# Altium project İHA-PDU.PrjPcb (part 10 of 13)
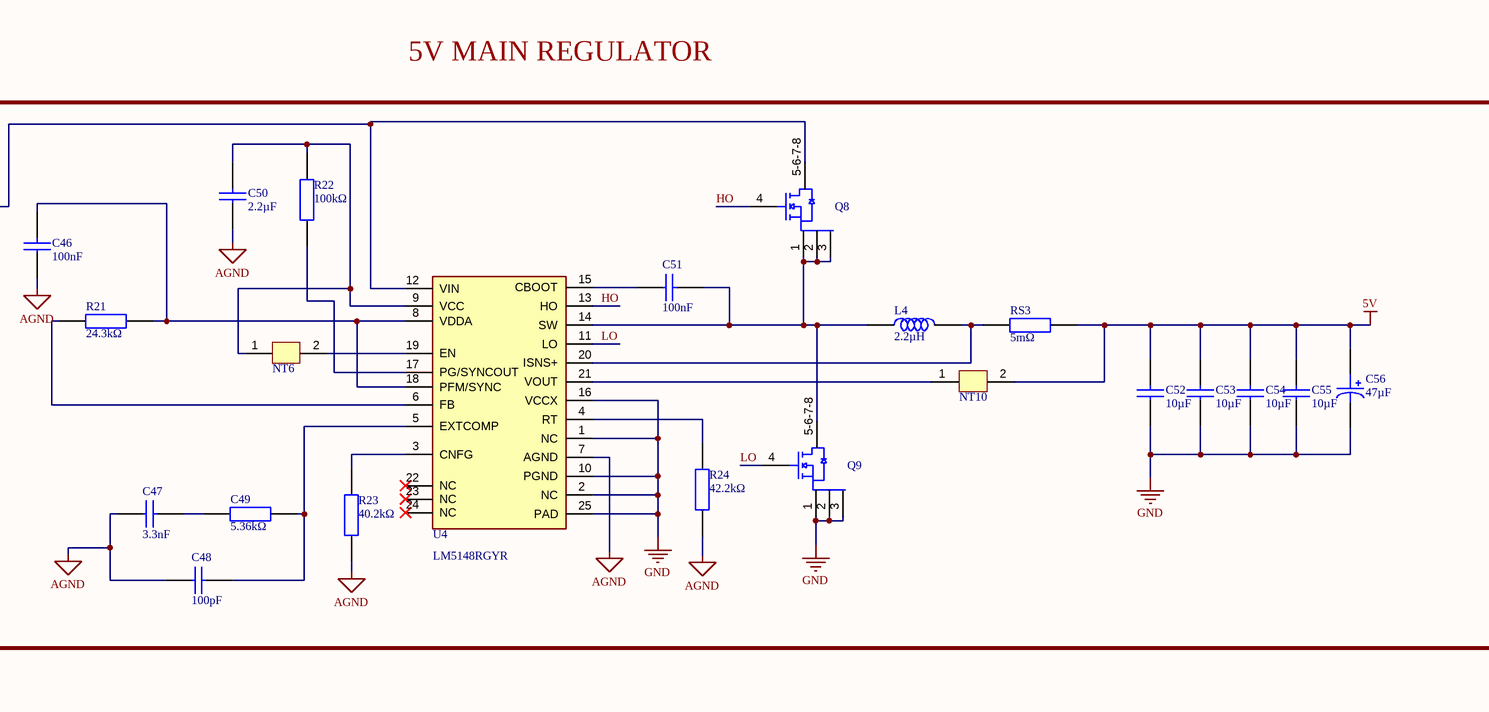
[diagram p16: 5V_Power_Stage.SchDoc, right]

## Sheet 5V_Power_Stage.SchDoc (continued)
### Library data of the parts
C44 C56 = EEHZA1H470P: Conductive Polymer Hybrid Aluminum Electrolytic Capacitors, 47µF, 50V, -55 to 105¡C; Manufacturer: Panasonic; Manufacturer Part Number: EEH-ZA1H470P; Manufacturer Lifecycle Status: ACTIVE; Part Series: ZA (High temp. reflow); ESR (Equivalent Series Resistance): 30mΩ; Leakage Current: 23.5µA; Life (Hours): 10000hours; Ripple Current: 1.8A; Tolerance: 20%; Supplier: Farnell; Supplier Part Number: EEHZA1H470P; RoHS: Compliant; Category: Aluminum Electrolytic Capacitors; Stock: 93; Pricing: 1=1,14, 10=0,637, 50=0,607, 100=0,576, 200=0,528, 500=0,479 (EUR); Case/Package: 3333; Country of Origin: Japan; Diameter: 8mm; Export Control Classification Number (ECCN) Code: EAR99; Height: 10.2mm; Harmonized Tariff Schedule (HTS) Code: 8532.22.00.20; Introduction Date: 2019-05-31; Length: 10.2mm; Lifecycle Status: Production; Material: Polymer; Max Operating Temperature: 105°C; Min Operating Temperature: -55°C; Mounting Technology: Surface Mount; Number of Terminals: 2; Ratings: AEC-Q200; REACH SVHC: Yes; Voltage Rating: 50V; Voltage Rating (DC): 50V; Width: 8.3mm; ComponentLink1URL: https://datasheet.octopart.com:443/EEH-ZA1H470P-Panasonic-datasheet-68301292.pdf?src-supplier=Panasonic; ComponentLink1Description: https://datasheet.octopart.com:443/EEH-ZA1H470P-Panasonic-datasheet-68301292.pdf?src-supplier=Panasonic; ComponentLink2URL: https://datasheet.octopart.com:443/EEH-ZA1H470P-Panasonic-datasheet-136612405.pdf?src-supplier=Electro+Sonic; ComponentLink2Description: https://datasheet.octopart.com:443/EEH-ZA1H470P-Panasonic-datasheet-136612405.pdf?src-supplier=Electro+Sonic; ComponentLink3URL: https://datasheet.octopart.com:443/EEHZA1H470P-Panasonic-datasheet-137675046.pdf?src-supplier=TME; ComponentLink3Description: https://datasheet.octopart.com:443/EEHZA1H470P-Panasonic-datasheet-137675046.pdf?src-supplier=TME
C45 = C3216X7R1H106K160AC: 50V 10uF X7R 卤10% 1206 Multilayer Ceramic Capacitors MLCC - SMD/SMT ROHS; Manufacturer: TDK; Manufacturer Lifecycle Status: PRODUCTION; Supplier: Farnell; Supplier Part Number: C3216X7R1H106K160AC; Manufacturer Part Number: C3216X7R1H106K160AC; RoHS: Compliant; Category: Ceramic Capacitors; Stock: 6363; Pricing: 5=0,77, 50=0,378, 250=0,344, 500=0,286, 1000=0,268, 2000=0,259 (EUR); Case/Package: 1206; Case Code (Metric): 3216; China RoHS: Compliant; Dielectric: X7R; Dielectric Material: Ceramic; Export Control Classification Number (ECCN) Code: EAR99; Height: 1.6mm; Harmonized Tariff Schedule (HTS) Code: 8532.24.00.20; Introduction Date: 2018-03-29; Lead Free: Lead Free; Length: 3.2mm; Lifecycle Status: Production; Material: Ceramic; Max Length: 3.5mm; Max Operating Temperature: 125°C; Max Width: 1.9mm; Min Length: 3.1mm; Min Operating Temperature: -55°C; Min Width: 1.5mm; Mounting Technology: Surface Mount; Number of Terminals: 2; REACH SVHC: Yes; Schedule B: 8532240020, 8532240020|8532240020|8532240020|8532240020|8532240020; Thickness: 1.6mm; Voltage Rating: 50V; Voltage Rating (DC): 50V; Width: 1.6mm; ComponentLink1URL: https://datasheet.octopart.com:443/C3216X7R1H106K160AC-TDK-datasheet-175423548.pdf?src-supplier=TME; ComponentLink1Description: https://datasheet.octopart.com:443/C3216X7R1H106K160AC-TDK-datasheet-175423548.pdf?src-supplier=TME; ComponentLink2URL: https://datasheet.octopart.com:443/C3216X7R1H106K160AC-TDK-datasheet-182135025.pdf?src-supplier=TME; ComponentLink2Description: https://datasheet.octopart.com:443/C3216X7R1H106K160AC-TDK-datasheet-182135025.pdf?src-supplier=TME; ComponentLink3URL: https://datasheet.octopart.com:443/C3216X7R1H106K160AC-TDK-datasheet-159617022.pdf?src-supplier=TME; ComponentLink3Description: https://datasheet.octopart.com:443/C3216X7R1H106K160AC-TDK-datasheet-159617022.pdf?src-supplier=TME; ComponentLink4URL: https://datasheet.octopart.com:443/C3216X7R1H106K160AC-TDK-datasheet-151546523.pdf?src-supplier=ODG+(Origin+Data+Global); ComponentLink4Description: https://datasheet.octopart.com:443/C3216X7R1H106K160AC-TDK-datasheet-151546523.pdf?src-supplier=ODG+(Origin+Data+Global); ComponentLink5URL: https://datasheet.octopart.com/C3216X7R1H106K160AC-TDK-datasheet-41194876.pdf; ComponentLink5Description: https://datasheet.octopart.com/C3216X7R1H106K160AC-TDK-datasheet-41194876.pdf; ComponentLink6URL: https://datasheet.octopart.com/C-Series-Ceramic-Chip-Capacitors-TDK-datasheet-family-84.pdf; ComponentLink6Description: https://datasheet.octopart.com/C-Series-Ceramic-Chip-Capacitors-TDK-datasheet-family-84.pdf; ComponentLink7URL: http://sigma.octopart.com:80/rohs_certificate/C-Series-Ceramic-Chip-Capacitors-TDK-family-108.pdf?src-supplier=Compliance+Statements; ComponentLink7Description: http://sigma.octopart.com:80/rohs_certificate/C-Series-Ceramic-Chip-Capacitors-TDK-family-108.pdf?src-supplier=Compliance+Statements
C46 C51 = GRM155R71A104KA01D: 10V 100nF X7R ±10% 0402 Multilayer Ceramic Capacitors MLCC - SMD/SMT ROHS; Manufacturer: Murata; Manufacturer Lifecycle Status: NRND; Dissipation Factor: 0.035%; Supplier: Farnell; Supplier Part Number: GRM155R71A104KA01D; Manufacturer Part Number: GRM155R71A104KA01D; RoHS: Compliant; Category: Ceramic Capacitors; Stock: 200000; Pricing: 10000=0,0029 (EUR); Case/Package: 0402; Case Code (Imperial): 0402; Case Code (Metric): 1005; Country of Origin: Japan, Mainland China, Philippines, Singapore, Thailand; Depth: 500µm; Dielectric: X7R; Dielectric Material: Ceramic; Export Control Classification Number (ECCN) Code: EAR99; Height: 500µm; Harmonized Tariff Schedule (HTS) Code: 8532.24.00.20; Introduction Date: 2004-11-19; Lead Free: Lead Free; Length: 1mm; Lifecycle Status: NRND; Material: Ceramic; Max Operating Temperature: 125°C; Min Operating Temperature: -55°C; Mounting Technology: Surface Mount; Pins: 2; Number of Terminals: 2; Packaging: Cut Tape; Radiation Hardening: No; REACH SVHC: Yes; Schedule B: 8532240020, 8532240020|8532240020, 8532240020|8532240020|8532240020, 8532240020|8532240020|8532240020|8532240020; Termination: SMD/SMT; Thickness: 500µm; Tolerance: 10%; Voltage: 10V; Voltage Rating: 10V; Voltage Rating (DC): 10V; Width: 500µm; ComponentLink1URL: https://datasheet.octopart.com:443/GRM155R71A104KA01D-Murata-datasheet-62317114.pdf?src-supplier=element14+APAC; ComponentLink1Description: https://datasheet.octopart.com:443/GRM155R71A104KA01D-Murata-datasheet-62317114.pdf?src-supplier=element14+APAC; ComponentLink2URL: https://datasheet.octopart.com:443/GRM155R71A104KA01D-Murata-datasheet-17853094.pdf?src-supplier=element14+APAC; ComponentLink2Description: https://datasheet.octopart.com:443/GRM155R71A104KA01D-Murata-datasheet-17853094.pdf?src-supplier=element14+APAC; ComponentLink3URL: https://datasheet.octopart.com/GRM155R71A104KA01D-Murata-datasheet-12515295.pdf; ComponentLink3Description: https://datasheet.octopart.com/GRM155R71A104KA01D-Murata-datasheet-12515295.pdf; ComponentLink4URL: https://datasheet.octopart.com/GRM155R71A104KA01D-Murata-datasheet-12510076.pdf; ComponentLink4Description: https://datasheet.octopart.com/GRM155R71A104KA01D-Murata-datasheet-12510076.pdf; ComponentLink5URL: https://datasheet.octopart.com/GRM155R71A104KA01D-Murata-datasheet-11978611.pdf; ComponentLink5Description: https://datasheet.octopart.com/GRM155R71A104KA01D-Murata-datasheet-11978611.pdf; ComponentLink6URL: https://datasheet.octopart.com/GRM155R71A104KA01D-Murata-datasheet-10025737.pdf; ComponentLink6Description: https://datasheet.octopart.com/GRM155R71A104KA01D-Murata-datasheet-10025737.pdf; ComponentLink7URL: https://datasheet.octopart.com/GRM155R71A104KA01D-Murata-datasheet-8819587.pdf; ComponentLink7Description: https://datasheet.octopart.com/GRM155R71A104KA01D-Murata-datasheet-8819587.pdf; ComponentLink8URL: https://datasheet.octopart.com/GRM155R71A104KA01D-Murata-datasheet-14400553.pdf; ComponentLink8Description: https://datasheet.octopart.com/GRM155R71A104KA01D-Murata-datasheet-14400553.pdf; ComponentLink9URL: https://datasheet.octopart.com:443/GRM155R71A104KA01D-Murata-datasheet-8817987.pdf?src-supplier=Newark; ComponentLink9Description: https://datasheet.octopart.com:443/GRM155R71A104KA01D-Murata-datasheet-8817987.pdf?src-supplier=Newark; ComponentLink10URL: https://datasheet.octopart.com:443/GRM155R71A104KA01D-Murata-datasheet-141266224.pdf?src-supplier=Ciiva; ComponentLink10Description: https://datasheet.octopart.com:443/GRM155R71A104KA01D-Murata-datasheet-141266224.pdf?src-supplier=Ciiva; ComponentLink11URL: https://datasheet.octopart.com:443/GRM155R71A104KA01D-Murata-datasheet-140690910.pdf?src-supplier=Ciiva; ComponentLink11Description: https://datasheet.octopart.com:443/GRM155R71A104KA01D-Murata-datasheet-140690910.pdf?src-supplier=Ciiva; ComponentLink12URL: https://datasheet.octopart.com:443/GRM155R71A104KA01D-Murata-datasheet-138740856.pdf?src-supplier=Ciiva; ComponentLink12Description: https://datasheet.octopart.com:443/GRM155R71A104KA01D-Murata-datasheet-138740856.pdf?src-supplier=Ciiva; ComponentLink13URL: https://datasheet.octopart.com:443/GRM155R71A104KA01D-Murata-datasheet-81455577.pdf?src-supplier=TME; ComponentLink13Description: https://datasheet.octopart.com:443/GRM155R71A104KA01D-Murata-datasheet-81455577.pdf?src-supplier=TME; ComponentLink14URL: https://datasheet.octopart.com:443/GRM155R71A104KA01D-Murata-datasheet-22122223.pdf?src-supplier=Future+Electronics; ComponentLink14Description: https://datasheet.octopart.com:443/GRM155R71A104KA01D-Murata-datasheet-22122223.pdf?src-supplier=Future+Electronics; ComponentLink15URL: https://datasheet.octopart.com:443/GRM155R71A104KA01D-Murata-datasheet-11966204.pdf?src-supplier=Arrow+Electronics; ComponentLink15Description: https://datasheet.octopart.com:443/GRM155R71A104KA01D-Murata-datasheet-11966204.pdf?src-supplier=Arrow+Electronics; ComponentLink16URL: https://datasheet.octopart.com:443/GRM155R71A104KA01D-Murata-datasheet-7576002.pdf?src-supplier=Jameco; ComponentLink16Description: https://datasheet.octopart.com:443/GRM155R71A104KA01D-Murata-datasheet-7576002.pdf?src-supplier=Jameco; ComponentLink17URL: https://datasheet.octopart.com:443/GRM155R71A104KA01D-Murata-datasheet-8326030.pdf?src-supplier=_legacy+Avnet; ComponentLink17Description: https://datasheet.octopart.com:443/GRM155R71A104KA01D-Murata-datasheet-8326030.pdf?src-supplier=_legacy+Avnet; ComponentLink18URL: https://datasheet.octopart.com:443/GRM155R71A104KA01D-Murata-datasheet-148211.pdf?src-supplier=Garrett; ComponentLink18Description: https://datasheet.octopart.com:443/GRM155R71A104KA01D-Murata-datasheet-148211.pdf?src-supplier=Garrett; ComponentLink19URL: http://sigma.octopart.com:80/reach_statement/Murata-company-16.pdf?src-supplier=Compliance+Statements; ComponentLink19Description: http://sigma.octopart.com:80/reach_statement/Murata-company-16.pdf?src-supplier=Compliance+Statements
C47 = CGA4C2C0G1H332J060AA: 50V 3.3nF C0G 卤5% 0805 Multilayer Ceramic Capacitors MLCC - SMD/SMT ROHS; Manufacturer: TDK; Manufacturer Lifecycle Status: PRODUCTION; Manufacturer Package Identifier: 0805 (2012 metric); Temperature Coefficient: 30ppm/°C; Tolerance: 5%; Supplier: Farnell; Supplier Part Number: CGA4C2C0G1H332J060AA; Manufacturer Part Number: CGA4C2C0G1H332J060AA; RoHS: Compliant; Category: Ceramic Capacitors; Stock: 1840; Pricing: 10=0,0623, 100=0,0545, 500=0,0415, 1000=0,038, 2000=0,0372, 4000=0,0251 (EUR); Case/Package: 0805; Case Code (Imperial): 0805; Case Code (Metric): 2012; China RoHS: Compliant; Composition: Ceramic; Depth: 1.25mm; Dielectric: C0G; Dielectric Material: Ceramic; Height: 600µm; Length: 2mm; Lifecycle Status: Production; Material: Ceramic; Max Length: 2.2mm; Max Operating Temperature: 125°C; Max Width: 1.45mm; Min Length: 1.8mm; Min Operating Temperature: -55°C; Min Width: 1.05mm; Mounting Technology: Surface Mount; Number of Terminals: 2; Packaging: Digi-Reel®; Ratings: AEC-Q200; REACH SVHC: Yes; Schedule B: 8532240020, 8532240020|8532240020|8532240020|8532240020|8532240020; Termination: SMD/SMT; Thickness: 762µm; Voltage Rating: 50V; Voltage Rating (DC): 50V; Weight: 5.499807mg; Width: 1.25mm; ComponentLink1URL: https://datasheet.octopart.com:443/CGA4C2C0G1H332J060AA-TDK-datasheet-165583812.pdf?src-supplier=IHS; ComponentLink1Description: https://datasheet.octopart.com:443/CGA4C2C0G1H332J060AA-TDK-datasheet-165583812.pdf?src-supplier=IHS; ComponentLink2URL: https://datasheet.octopart.com:443/CGA4C2C0G1H332J060AA-TDK-datasheet-138890726.pdf?src-supplier=Upverter; ComponentLink2Description: https://datasheet.octopart.com:443/CGA4C2C0G1H332J060AA-TDK-datasheet-138890726.pdf?src-supplier=Upverter; ComponentLink3URL: https://datasheet.octopart.com:443/CGA4C2C0G1H332J060AA-TDK-datasheet-151546526.pdf?src-supplier=TDK; ComponentLink3Description: https://datasheet.octopart.com:443/CGA4C2C0G1H332J060AA-TDK-datasheet-151546526.pdf?src-supplier=TDK; ComponentLink4URL: https://datasheet.octopart.com:443/CGA4C2C0G1H332J060AA-TDK-datasheet-43366117.pdf?src-supplier=Future+Electronics; ComponentLink4Description: https://datasheet.octopart.com:443/CGA4C2C0G1H332J060AA-TDK-datasheet-43366117.pdf?src-supplier=Future+Electronics
C48 = CL21C101JBANNNC: 50V 100pF C0G 卤5% 0805 Multilayer Ceramic Capacitors MLCC - SMD/SMT ROHS; Manufacturer: Samsung Electro-Mechanics; Temperature Coefficient: 30ppm/°C; Tolerance: 5%; Supplier: Future Electronics; Supplier Part Number: CL21C101JBANNNC; Manufacturer Part Number: CL21C101JBANNNC; RoHS: Compliant; Category: Ceramic Capacitors; Stock: 908000; Pricing: 4000=0,0045, 16000=0,0043, 60000=0,0041, 100000=0,0041, 200000=0,0039 (USD); Case/Package: 0805; Case Code (Imperial): 0805; Case Code (Metric): 2012; China RoHS: Compliant; Contact Plating: Tin; Depth: 1.25mm; Dielectric: C0G; Dielectric Material: Ceramic; Height: 750µm; Lead Free: Lead Free; Length: 2mm; Lifecycle Status: Production; Material: Ceramic; Max Operating Temperature: 125°C; Min Operating Temperature: -55°C; Mounting Technology: Surface Mount; Number of Terminals: 2; Radiation Hardening: No; REACH SVHC: Yes; Schedule B: 8532240020, 8532240020|8532240020, 8532240020|8532240020|8532240020, 8532240020|8532240020|8532240020|8532240020; Thickness: 762µm; Voltage: 50V; Voltage Rating: 50V; Voltage Rating (DC): 50V; Width: 1.25mm; ComponentLink1URL: https://datasheet.octopart.com:443/CL21C101JBANNNC-Samsung-Electro-Mechanics-datasheet-136482554.pdf?src-supplier=IHS; ComponentLink1Description: https://datasheet.octopart.com:443/CL21C101JBANNNC-Samsung-Electro-Mechanics-datasheet-136482554.pdf?src-supplier=IHS; ComponentLink2URL: https://datasheet.octopart.com/CL21C101JBANNNC-Samsung-Electro-Mechanics-datasheet-8324245.pdf; ComponentLink2Description: https://datasheet.octopart.com/CL21C101JBANNNC-Samsung-Electro-Mechanics-datasheet-8324245.pdf; ComponentLink3URL: https://datasheet.octopart.com/CL21C101JBANNNC-Samsung-Electro-Mechanics-datasheet-97040617.pdf; ComponentLink3Description: https://datasheet.octopart.com/CL21C101JBANNNC-Samsung-Electro-Mechanics-datasheet-97040617.pdf; ComponentLink4URL: https://datasheet.octopart.com/General-Multilayer-Ceramic-Capacitors-Samsung-datasheet-family-111.pdf; ComponentLink4Description: https://datasheet.octopart.com/General-Multilayer-Ceramic-Capacitors-Samsung-datasheet-family-111.pdf; ComponentLink5URL: https://datasheet.octopart.com:443/CL21C101JBANNNC-Samsung-Electro-Mechanics-datasheet-110334054.pdf?src-supplier=Future+Electronics; ComponentLink5Description: https://datasheet.octopart.com:443/CL21C101JBANNNC-Samsung-Electro-Mechanics-datasheet-110334054.pdf?src-supplier=Future+Electronics; ComponentLink6URL: https://datasheet.octopart.com:443/CL21C101JBANNNC-Samsung-Electro-Mechanics-datasheet-81462297.pdf?src-supplier=Future+Electronics; ComponentLink6Description: https://datasheet.octopart.com:443/CL21C101JBANNNC-Samsung-Electro-Mechanics-datasheet-81462297.pdf?src-supplier=Future+Electronics; ComponentLink7URL: https://datasheet.octopart.com:443/CL21C101JBANNNC-Samsung-datasheet-48647683.pdf?src-supplier=Future+Electronics; ComponentLink7Description: https://datasheet.octopart.com:443/CL21C101JBANNNC-Samsung-datasheet-48647683.pdf?src-supplier=Future+Electronics; ComponentLink8URL: https://datasheet.octopart.com:443/CL21C101JBANNNC-Samsung-datasheet-26669372.pdf?src-supplier=Future+Electronics; ComponentLink8Description: https://datasheet.octopart.com:443/CL21C101JBANNNC-Samsung-datasheet-26669372.pdf?src-supplier=Future+Electronics; ComponentLink9URL: https://datasheet.octopart.com:443/CL21C101JBANNNC-Samsung-Electro-Mechanics-datasheet-149066777.pdf?src-supplier=Future+Electronics; ComponentLink9Description: https://datasheet.octopart.com:443/CL21C101JBANNNC-Samsung-Electro-Mechanics-datasheet-149066777.pdf?src-supplier=Future+Electronics; ComponentLink10URL: https://datasheet.octopart.com:443/CL21C101JBANNNC-Samsung-datasheet-8326407.pdf?src-supplier=TME; ComponentLink10Description: https://datasheet.octopart.com:443/CL21C101JBANNNC-Samsung-datasheet-8326407.pdf?src-supplier=TME; ComponentLink11URL: http://sigma.octopart.com:80/rohs_certificate/General-Multilayer-Ceramic-Capacitors-Samsung-family-110.pdf?src-supplier=Compliance+Statements; ComponentLink11Description: http://sigma.octopart.com:80/rohs_certificate/General-Multilayer-Ceramic-Capacitors-Samsung-family-110.pdf?src-supplier=Compliance+Statements; ComponentLink12URL: http://sigma.octopart.com:80/rohs_statement/General-Multilayer-Ceramic-Capacitors-Samsung-family-132.pdf?src-supplier=Compliance+Statements; ComponentLink12Description: http://sigma.octopart.com:80/rohs_statement/General-Multilayer-Ceramic-Capacitors-Samsung-family-132.pdf?src-supplier=Compliance+Statements; ComponentLink13URL: http://sigma.octopart.com:80/reach_statement/General-Multilayer-Ceramic-Capacitors-Samsung-family-133.pdf?src-supplier=Compliance+Statements; ComponentLink13Description: http://sigma.octopart.com:80/reach_statement/General-Multilayer-Ceramic-Capacitors-Samsung-family-133.pdf?src-supplier=Compliance+Statements
C49 = CRCW04025K36FKED: Res Thick Film 0402 5.36K Ohm 1% 0.063W(1/16W) ±100ppm/C Pad SMD T/R Automotive AEC-Q200; Manufacturer: Vishay; Max Power Dissipation: 63mW; Temperature Coefficient: 100ppm/°C; Voltage Rating: 50V; Supplier: Farnell; Supplier Part Number: CRCW04025K36FKED; Manufacturer Part Number: CRCW04025K36FKED; RoHS: Compliant; Category: Chip SMD Resistors; Stock: 11400; Pricing: 10=0,02, 100=0,0145, 500=0,0117, 2500=0,0097, 5000=0,0095 (EUR); Case/Package: 0402; Case Code (Imperial): 0402; China RoHS: Non-Compliant; Composition: Thick Film; Contact Plating: Tin; Depth: 500µm; Features: Automotive AEC-Q200; Height: 350µm; Lead Free: Lead Free; Length: 1mm; Lifecycle Status: Production; Max Operating Temperature: 155°C; Military Standard: Not; Min Operating Temperature: -55°C; Mounting Technology: Surface Mount; Pins: 2; Number of Terminals: 2; Number of Terminations: 2; Packaging: Cut Tape; Power Rating: 63mW; Radiation Hardening: No; Ratings: AEC-Q200; REACH SVHC: Yes; Tolerance: 1%; Voltage Rating (DC): 50V; Weight: 652.039032µg; Width: 500µm; Working Voltage: 50V; ComponentLink1URL: https://datasheet.octopart.com:443/CRCW04025K36FKED-Vishay-datasheet-175423584.pdf?src-supplier=IHS; ComponentLink1Description: https://datasheet.octopart.com:443/CRCW04025K36FKED-Vishay-datasheet-175423584.pdf?src-supplier=IHS; ComponentLink2URL: https://datasheet.octopart.com:443/CRCW04025K36FKED.-Vishay-datasheet-83961561.pdf?src-supplier=element14+APAC; ComponentLink2Description: https://datasheet.octopart.com:443/CRCW04025K36FKED.-Vishay-datasheet-83961561.pdf?src-supplier=element14+APAC; ComponentLink3URL: https://datasheet.octopart.com:443/CRCW04025K36FKED-Vishay-datasheet-62317936.pdf?src-supplier=element14+APAC; ComponentLink3Description: https://datasheet.octopart.com:443/CRCW04025K36FKED-Vishay-datasheet-62317936.pdf?src-supplier=element14+APAC; ComponentLink4URL: https://datasheet.octopart.com:443/CRCW04025K36FKED-Vishay-datasheet-14722531.pdf?src-supplier=element14+APAC; ComponentLink4Description: https://datasheet.octopart.com:443/CRCW04025K36FKED-Vishay-datasheet-14722531.pdf?src-supplier=element14+APAC; ComponentLink5URL: https://datasheet.octopart.com:443/CRCW04025K36FKED.-Vishay-datasheet-78776211.pdf?src-supplier=Newark; ComponentLink5Description: https://datasheet.octopart.com:443/CRCW04025K36FKED.-Vishay-datasheet-78776211.pdf?src-supplier=Newark; ComponentLink6URL: https://datasheet.octopart.com:443/CRCW04025K36FKED-Vishay-datasheet-66077789.pdf?src-supplier=Newark; ComponentLink6Description: https://datasheet.octopart.com:443/CRCW04025K36FKED-Vishay-datasheet-66077789.pdf?src-supplier=Newark; ComponentLink7URL: https://datasheet.octopart.com:443/CRCW04025K36FKED-Vishay-datasheet-11761042.pdf?src-supplier=Newark; ComponentLink7Description: https://datasheet.octopart.com:443/CRCW04025K36FKED-Vishay-datasheet-11761042.pdf?src-supplier=Newark; ComponentLink8URL: https://datasheet.octopart.com:443/CRCW04025K36FKED-Vishay-datasheet-11516975.pdf?src-supplier=Newark; ComponentLink8Description: https://datasheet.octopart.com:443/CRCW04025K36FKED-Vishay-datasheet-11516975.pdf?src-supplier=Newark; ComponentLink9URL: https://datasheet.octopart.com:443/CRCW04025K36FKED-Vishay-datasheet-159614168.pdf?src-supplier=Newark; ComponentLink9Description: https://datasheet.octopart.com:443/CRCW04025K36FKED-Vishay-datasheet-159614168.pdf?src-supplier=Newark; ComponentLink10URL: https://datasheet.octopart.com:443/CRCW04025K36FKED-Vishay-datasheet-41302739.pdf?src-supplier=Newark; ComponentLink10Description: https://datasheet.octopart.com:443/CRCW04025K36FKED-Vishay-datasheet-41302739.pdf?src-supplier=Newark; ComponentLink11URL: https://datasheet.octopart.com:443/CRCW04025K36FKED-Vishay-datasheet-62316122.pdf?src-supplier=Future+Electronics; ComponentLink11Description: https://datasheet.octopart.com:443/CRCW04025K36FKED-Vishay-datasheet-62316122.pdf?src-supplier=Future+Electronics; ComponentLink12URL: https://datasheet.octopart.com:443/CRCW04025K36FKED-Vishay-datasheet-5377255.pdf?src-supplier=Garrett; ComponentLink12Description: https://datasheet.octopart.com:443/CRCW04025K36FKED-Vishay-datasheet-5377255.pdf?src-supplier=Garrett; ComponentLink13URL: https://datasheet.octopart.com:443/CRCW04025K36FKED-Vishay-datasheet-148188.pdf?src-supplier=Garrett; ComponentLink13Description: https://datasheet.octopart.com:443/CRCW04025K36FKED-Vishay-datasheet-148188.pdf?src-supplier=Garrett; ComponentLink14URL: https://datasheet.octopart.com:443/CRCW04025K36FKED-Vishay-datasheet-42367.pdf?src-supplier=Garrett; ComponentLink14Description: https://datasheet.octopart.com:443/CRCW04025K36FKED-Vishay-datasheet-42367.pdf?src-supplier=Garrett; ComponentLink15URL: http://sigma.octopart.com:80/rohs_statement/Vishay-company-15.pdf?src-supplier=Compliance+Statements; ComponentLink15Description: http://sigma.octopart.com:80/rohs_statement/Vishay-company-15.pdf?src-supplier=Compliance+Statements
C50 = GRM188R71A225KE15D: 10V 2.2uF X7R ±10% 0603 Multilayer Ceramic Capacitors MLCC - SMD/SMT ROHS; Manufacturer: Murata; Manufacturer Lifecycle Status: IN PRODUCTION; Supplier: Farnell; Supplier Part Number: GRM188R71A225KE15D; Manufacturer Part Number: GRM188R71A225KE15D; RoHS: Compliant; Category: Ceramic Capacitors; Stock: 68000; Pricing: 4000=0,022 (EUR); Case/Package: 0603; Case Code (Imperial): 0603; Case Code (Metric): 1608; Country of Origin: Philippines; Depth: 800µm; Dielectric: X7R; Dielectric Material: Ceramic; Export Control Classification Number (ECCN) Code: EAR99; Height: 800µm; Harmonized Tariff Schedule (HTS) Code: 8532.24.00.20; Introduction Date: 2006-06-22; Lead Free: Lead Free; Length: 1.6mm; Lifecycle Status: Production; Material: Ceramic; Max Operating Temperature: 125°C; Min Operating Temperature: -55°C; Mounting Technology: Surface Mount; Pins: 2; Number of Terminals: 2; Packaging: Cut Tape; REACH SVHC: Yes; Schedule B: 8532240020, 8532240020|8532240020, 8532240020|8532240020|8532240020, 8532240020|8532240020|8532240020|8532240020; Termination: SMD/SMT; Thickness: 800µm; Tolerance: 10%; Voltage: 10V; Voltage Rating: 10V; Voltage Rating (DC): 10V; Weight: 2.012816mg; Width: 800µm; ComponentLink1URL: https://datasheet.octopart.com:443/GRM188R71A225KE15D-Murata-datasheet-62317205.pdf?src-supplier=element14+APAC; ComponentLink1Description: https://datasheet.octopart.com:443/GRM188R71A225KE15D-Murata-datasheet-62317205.pdf?src-supplier=element14+APAC; ComponentLink2URL: https://datasheet.octopart.com:443/GRM188R71A225KE15D-Murata-datasheet-14713224.pdf?src-supplier=element14+APAC; ComponentLink2Description: https://datasheet.octopart.com:443/GRM188R71A225KE15D-Murata-datasheet-14713224.pdf?src-supplier=element14+APAC; ComponentLink3URL: https://datasheet.octopart.com:443/GRM188R71A225KE15D-Murata-datasheet-8814637.pdf?src-supplier=Newark; ComponentLink3Description: https://datasheet.octopart.com:443/GRM188R71A225KE15D-Murata-datasheet-8814637.pdf?src-supplier=Newark; ComponentLink4URL: https://datasheet.octopart.com/GRM188R71A225KE15D-Murata-datasheet-12526711.pdf; ComponentLink4Description: https://datasheet.octopart.com/GRM188R71A225KE15D-Murata-datasheet-12526711.pdf; ComponentLink5URL: https://datasheet.octopart.com/GRM188R71A225KE15D-Murata-datasheet-12515295.pdf; ComponentLink5Description: https://datasheet.octopart.com/GRM188R71A225KE15D-Murata-datasheet-12515295.pdf; ComponentLink6URL: https://datasheet.octopart.com/GRM188R71A225KE15D-Murata-datasheet-12510076.pdf; ComponentLink6Description: https://datasheet.octopart.com/GRM188R71A225KE15D-Murata-datasheet-12510076.pdf; ComponentLink7URL: https://datasheet.octopart.com/GRM188R71A225KE15D-Murata-datasheet-11978611.pdf; ComponentLink7Description: https://datasheet.octopart.com/GRM188R71A225KE15D-Murata-datasheet-11978611.pdf; ComponentLink8URL: https://datasheet.octopart.com/GRM188R71A225KE15D-Murata-datasheet-10025737.pdf; ComponentLink8Description: https://datasheet.octopart.com/GRM188R71A225KE15D-Murata-datasheet-10025737.pdf; ComponentLink9URL: https://datasheet.octopart.com/GRM188R71A225KE15D-Murata-datasheet-8819587.pdf; ComponentLink9Description: https://datasheet.octopart.com/GRM188R71A225KE15D-Murata-datasheet-8819587.pdf; ComponentLink10URL: https://datasheet.octopart.com:443/GRM188R71A225KE15D-Murata-datasheet-165579666.pdf?src-supplier=TME; ComponentLink10Description: https://datasheet.octopart.com:443/GRM188R71A225KE15D-Murata-datasheet-165579666.pdf?src-supplier=TME; ComponentLink11URL: https://datasheet.octopart.com:443/GRM188R71A225KE15D-Murata-datasheet-59876780.pdf?src-supplier=TME; ComponentLink11Description: https://datasheet.octopart.com:443/GRM188R71A225KE15D-Murata-datasheet-59876780.pdf?src-supplier=TME; ComponentLink12URL: https://datasheet.octopart.com:443/GRM188R71A225KE15D-Murata-datasheet-141274968.pdf?src-supplier=Ciiva; ComponentLink12Description: https://datasheet.octopart.com:443/GRM188R71A225KE15D-Murata-datasheet-141274968.pdf?src-supplier=Ciiva; ComponentLink13URL: https://datasheet.octopart.com:443/GRM188R71A225KE15D-Murata-datasheet-140705380.pdf?src-supplier=Ciiva; ComponentLink13Description: https://datasheet.octopart.com:443/GRM188R71A225KE15D-Murata-datasheet-140705380.pdf?src-supplier=Ciiva; ComponentLink14URL: https://datasheet.octopart.com:443/GRM188R71A225KE15D-Murata-datasheet-138742948.pdf?src-supplier=Ciiva; ComponentLink14Description: https://datasheet.octopart.com:443/GRM188R71A225KE15D-Murata-datasheet-138742948.pdf?src-supplier=Ciiva; ComponentLink15URL: https://datasheet.octopart.com:443/GRM188R71A225KE15D-Murata-datasheet-82944801.pdf?src-supplier=Future+Electronics; ComponentLink15Description: https://datasheet.octopart.com:443/GRM188R71A225KE15D-Murata-datasheet-82944801.pdf?src-supplier=Future+Electronics; ComponentLink16URL: https://datasheet.octopart.com:443/GRM188R71A225KE15D-Murata-datasheet-22122223.pdf?src-supplier=Future+Electronics; ComponentLink16Description: https://datasheet.octopart.com:443/GRM188R71A225KE15D-Murata-datasheet-22122223.pdf?src-supplier=Future+Electronics; ComponentLink17URL: https://datasheet.octopart.com:443/GRM188R71A225KE15D-Murata-datasheet-8324774.pdf?src-supplier=Future+Electronics; ComponentLink17Description: https://datasheet.octopart.com:443/GRM188R71A225KE15D-Murata-datasheet-8324774.pdf?src-supplier=Future+Electronics; ComponentLink18URL: https://datasheet.octopart.com:443/GRM188R71A225KE15D-Murata-datasheet-502279.pdf?src-supplier=Future+Electronics; ComponentLink18Description: https://datasheet.octopart.com:443/GRM188R71A225KE15D-Murata-datasheet-502279.pdf?src-supplier=Future+Electronics; ComponentLink19URL: https://datasheet.octopart.com:443/GRM188R71A225KE15D-Murata-datasheet-44107671.pdf?src-supplier=Future+Electronics; ComponentLink19Description: https://datasheet.octopart.com:443/GRM188R71A225KE15D-Murata-datasheet-44107671.pdf?src-supplier=Future+Electronics; ComponentLink20URL: https://datasheet.octopart.com:443/GRM188R71A225KE15D-Murata-datasheet-12510170.pdf?src-supplier=Factory+Futures; ComponentLink20Description: https://datasheet.octopart.com:443/GRM188R71A225KE15D-Murata-datasheet-12510170.pdf?src-supplier=Factory+Futures; ComponentLink21URL: https://datasheet.octopart.com:443/GRM188R71A225KE15D-Murata-datasheet-8517407.pdf?src-supplier=Factory+Futures; ComponentLink21Description: https://datasheet.octopart.com:443/GRM188R71A225KE15D-Murata-datasheet-8517407.pdf?src-supplier=Factory+Futures; ComponentLink22URL: https://datasheet.octopart.com:443/GRM188R71A225KE15D-Murata-datasheet-8387045.pdf?src-supplier=Factory+Futures; ComponentLink22Description: https://datasheet.octopart.com:443/GRM188R71A225KE15D-Murata-datasheet-8387045.pdf?src-supplier=Factory+Futures; ComponentLink23URL: https://datasheet.octopart.com:443/GRM188R71A225KE15D-Murata-datasheet-8324201.pdf?src-supplier=Factory+Futures; ComponentLink23Description: https://datasheet.octopart.com:443/GRM188R71A225KE15D-Murata-datasheet-8324201.pdf?src-supplier=Factory+Futures; ComponentLink24URL: https://datasheet.octopart.com:443/GRM188R71A225KE15D-Murata-datasheet-7628724.pdf?src-supplier=Factory+Futures; ComponentLink24Description: https://datasheet.octopart.com:443/GRM188R71A225KE15D-Murata-datasheet-7628724.pdf?src-supplier=Factory+Futures; ComponentLink25URL: https://datasheet.octopart.com:443/GRM188R71A225KE15D-Murata-datasheet-552801.pdf?src-supplier=Factory+Futures; ComponentLink25Description: https://datasheet.octopart.com:443/GRM188R71A225KE15D-Murata-datasheet-552801.pdf?src-supplier=Factory+Futures; ComponentLink26URL: https://datasheet.octopart.com:443/GRM188R71A225KE15D-Murata-datasheet-11727461.pdf?src-supplier=Arrow+Electronics; ComponentLink26Description: https://datasheet.octopart.com:443/GRM188R71A225KE15D-Murata-datasheet-11727461.pdf?src-supplier=Arrow+Electronics; ComponentLink27URL: https://datasheet.octopart.com:443/GRM188R71A225KE15D-Murata-datasheet-118811.pdf?src-supplier=DigiKey; ComponentLink27Description: https://datasheet.octopart.com:443/GRM188R71A225KE15D-Murata-datasheet-118811.pdf?src-supplier=DigiKey; ComponentLink28URL: http://sigma.octopart.com:80/reach_statement/Murata-company-16.pdf?src-supplier=Compliance+Statements; ComponentLink28Description: http://sigma.octopart.com:80/reach_statement/Murata-company-16.pdf?src-supplier=Compliance+Statements
C52-C55 = GRM31CR71E106KA12L: 25V 10uF X7R ±10% 1206 Multilayer Ceramic Capacitors MLCC - SMD/SMT ROHS; Manufacturer: Murata; Manufacturer Lifecycle Status: IN PRODUCTION; Supplier: Farnell; Supplier Part Number: GRM31CR71E106KA12L; Manufacturer Part Number: GRM31CR71E106KA12L; RoHS: Compliant; Category: Ceramic Capacitors; Stock: 33950; Pricing: 5=0,287, 50=0,122, 250=0,109, 500=0,085, 1000=0,0755 (EUR); Case/Package: 1206; Case Code (Imperial): 1206; Case Code (Metric): 3216; China RoHS: Compliant; Depth: 1.6mm; Dielectric: X7R; Dielectric Material: Ceramic; Height: 1.6mm; Lead Free: Lead Free; Length: 3.2mm; Lifecycle Status: Production; Material: Ceramic; Max Operating Temperature: 125°C; Min Operating Temperature: -55°C; Mounting Technology: Surface Mount; Pins: 2; Number of Terminals: 2; Packaging: Cut Tape; Radiation Hardening: No; REACH SVHC: Yes; Schedule B: 8532240020, 8532240020|8532240020, 8532240020|8532240020|8532240020, 8532240020|8532240020|8532240020|8532240020; Termination: SMD/SMT; Thickness: 1.6mm; Tolerance: 10%; Voltage: 25V; Voltage Rating: 25V; Voltage Rating (DC): 25V; Width: 1.6mm; ComponentLink1URL: https://datasheet.octopart.com:443/GRM31CR71E106KA12L-Murata-datasheet-32479577.pdf?src-supplier=Upverter; ComponentLink1Description: https://datasheet.octopart.com:443/GRM31CR71E106KA12L-Murata-datasheet-32479577.pdf?src-supplier=Upverter; ComponentLink2URL: https://datasheet.octopart.com:443/GRM31CR71E106KA12L-Murata-datasheet-62320264.pdf?src-supplier=Farnell; ComponentLink2Description: https://datasheet.octopart.com:443/GRM31CR71E106KA12L-Murata-datasheet-62320264.pdf?src-supplier=Farnell; ComponentLink3URL: https://datasheet.octopart.com:443/GRM31CR71E106KA12L-Murata-datasheet-7550257.pdf?src-supplier=Farnell; ComponentLink3Description: https://datasheet.octopart.com:443/GRM31CR71E106KA12L-Murata-datasheet-7550257.pdf?src-supplier=Farnell; ComponentLink4URL: https://datasheet.octopart.com:443/GRM31CR71E106KA12L-Murata-datasheet-8817987.pdf?src-supplier=Newark; ComponentLink4Description: https://datasheet.octopart.com:443/GRM31CR71E106KA12L-Murata-datasheet-8817987.pdf?src-supplier=Newark; ComponentLink5URL: https://datasheet.octopart.com:443/GRM31CR71E106KA12L-Murata-datasheet-8085059.pdf?src-supplier=element14+APAC; ComponentLink5Description: https://datasheet.octopart.com:443/GRM31CR71E106KA12L-Murata-datasheet-8085059.pdf?src-supplier=element14+APAC; ComponentLink6URL: https://datasheet.octopart.com:443/GRM31CR71E106KA12L-Murata-datasheet-17853182.pdf?src-supplier=element14+APAC; ComponentLink6Description: https://datasheet.octopart.com:443/GRM31CR71E106KA12L-Murata-datasheet-17853182.pdf?src-supplier=element14+APAC; ComponentLink7URL: https://datasheet.octopart.com:443/GRM31CR71E106KA12L-Murata-datasheet-14397761.pdf?src-supplier=Future+Electronics; ComponentLink7Description: https://datasheet.octopart.com:443/GRM31CR71E106KA12L-Murata-datasheet-14397761.pdf?src-supplier=Future+Electronics; ComponentLink8URL: https://datasheet.octopart.com:443/GRM31CR71E106KA12L-Murata-datasheet-22122223.pdf?src-supplier=Future+Electronics; ComponentLink8Description: https://datasheet.octopart.com:443/GRM31CR71E106KA12L-Murata-datasheet-22122223.pdf?src-supplier=Future+Electronics; ComponentLink9URL: https://datasheet.octopart.com:443/GRM31CR71E106KA12L-Murata-datasheet-12536416.pdf?src-supplier=Future+Electronics; ComponentLink9Description: https://datasheet.octopart.com:443/GRM31CR71E106KA12L-Murata-datasheet-12536416.pdf?src-supplier=Future+Electronics; ComponentLink10URL: https://datasheet.octopart.com:443/GRM31CR71E106KA12L-Murata-datasheet-38883574.pdf?src-supplier=Future+Electronics; ComponentLink10Description: https://datasheet.octopart.com:443/GRM31CR71E106KA12L-Murata-datasheet-38883574.pdf?src-supplier=Future+Electronics; ComponentLink11URL: https://datasheet.octopart.com:443/GRM31CR71E106KA12L-Murata-datasheet-165579666.pdf?src-supplier=TME; ComponentLink11Description: https://datasheet.octopart.com:443/GRM31CR71E106KA12L-Murata-datasheet-165579666.pdf?src-supplier=TME; ComponentLink12URL: https://datasheet.octopart.com:443/GRM31CR71E106KA12L-Murata-datasheet-59876780.pdf?src-supplier=TME; ComponentLink12Description: https://datasheet.octopart.com:443/GRM31CR71E106KA12L-Murata-datasheet-59876780.pdf?src-supplier=TME; ComponentLink13URL: https://datasheet.octopart.com:443/GRM31CR71E106KA12L-Murata-datasheet-140709144.pdf?src-supplier=Ciiva; ComponentLink13Description: https://datasheet.octopart.com:443/GRM31CR71E106KA12L-Murata-datasheet-140709144.pdf?src-supplier=Ciiva; ComponentLink14URL: https://datasheet.octopart.com:443/GRM31CR71E106KA12L-Murata-datasheet-138746391.pdf?src-supplier=Ciiva; ComponentLink14Description: https://datasheet.octopart.com:443/GRM31CR71E106KA12L-Murata-datasheet-138746391.pdf?src-supplier=Ciiva; ComponentLink15URL: https://datasheet.octopart.com:443/GRM31CR71E106KA12L-Murata-datasheet-102370999.pdf?src-supplier=HQonline; ComponentLink15Description: https://datasheet.octopart.com:443/GRM31CR71E106KA12L-Murata-datasheet-102370999.pdf?src-supplier=HQonline; ComponentLink16URL: https://datasheet.octopart.com/GRM31CR71E106KA12L-Murata-datasheet-12515295.pdf; ComponentLink16Description: https://datasheet.octopart.com/GRM31CR71E106KA12L-Murata-datasheet-12515295.pdf; ComponentLink17URL: https://datasheet.octopart.com/GRM31CR71E106KA12L-Murata-datasheet-12510076.pdf; ComponentLink17Description: https://datasheet.octopart.com/GRM31CR71E106KA12L-Murata-datasheet-12510076.pdf; ComponentLink18URL: https://datasheet.octopart.com/GRM31CR71E106KA12L-Murata-datasheet-11978611.pdf; ComponentLink18Description: https://datasheet.octopart.com/GRM31CR71E106KA12L-Murata-datasheet-11978611.pdf; ComponentLink19URL: https://datasheet.octopart.com/GRM31CR71E106KA12L-Murata-datasheet-10025737.pdf; ComponentLink19Description: https://datasheet.octopart.com/GRM31CR71E106KA12L-Murata-datasheet-10025737.pdf; ComponentLink20URL: https://datasheet.octopart.com/GRM31CR71E106KA12L-Murata-datasheet-8819587.pdf; ComponentLink20Description: https://datasheet.octopart.com/GRM31CR71E106KA12L-Murata-datasheet-8819587.pdf; ComponentLink21URL: https://datasheet.octopart.com:443/GRM31CR71E106KA12L-Murata-datasheet-151453090.pdf?src-supplier=Arrow.cn; ComponentLink21Description: https://datasheet.octopart.com:443/GRM31CR71E106KA12L-Murata-datasheet-151453090.pdf?src-supplier=Arrow.cn; ComponentLink22URL: http://sigma.octopart.com:80/reach_statement/Murata-company-16.pdf?src-supplier=Compliance+Statements; ComponentLink22Description: http://sigma.octopart.com:80/reach_statement/Murata-company-16.pdf?src-supplier=Compliance+Statements
L4 = XAL7070-222MEC: General Purpose Inductor, 2.2uH, 20%, 1 Element, Composite-Core, SMD, 3028; Manufacturer: Coilcraft; Manufacturer Part Number: XAL7070-222MEB; DC Resistance (DCR): 6.33mΩ; Max Current Rating: 17.8A; Number of Circuits: 1; Self Resonant Frequency: 35MHz; Shielding: Shielded; Test Frequency: 1MHz; Category: Fixed Inductors; Core Material: Composite; Country of Origin: Indonesia, Mainland China, Mexico; Export Control Classification Number (ECCN) Code: EAR99; Harmonized Tariff Schedule (HTS) Code: 8504.50.80.00; Height: 7mm; Introduction Date: 2011-03-10; Lead Free: Contains Lead; Length: 7.5mm; Lifecycle Status: Obsolete; LTB Date: 2021-03-01; LTD Date: 2021-03-01; Max DC Current: 17.8A; Max Operating Temperature: 125°C; Min Operating Temperature: -40°C; Number of Terminals: 2; Ratings: AEC-Q200; REACH SVHC: Yes; RoHS: Compliant; Termination: SMD/SMT; Tolerance: 20%; Width: 7.2mm; DataSheet: https://www.coilcraft.com/getmedia/1ba55433-bcc8-4838-9b21-382f497e12e0/xal7070.pdf
Q8 = CSD18540Q5B: 60-V, N channel NexFET™ power MOSFET, single SON 5 mm x 6 mm, 2.2 mOhm 8-VSON-CLIP -55 to 175; Manufacturer: Texas Instruments; Manufacturer Lifecycle Status: ACTIVE; Continuous Drain Current (ID): 29A; Drain to Source Resistance: 1.8mΩ; Drain to Source Voltage (Vdss): 60V; Fall Time: 3ns; Gate to Source Voltage (Vgs): 20V; Input Capacitance: 4.23nF; Max Junction Temperature (Tj): 175°C; Max Power Dissipation: 3.1W; Number of Channels: 1; Power Dissipation: 3.8W; Rds On Max: 2.2mΩ; Rise Time: 9ns; Turn-Off Delay Time: 20ns; Turn-On Delay Time: 6ns; Supplier: Arrow Electronics; Supplier Part Number: CSD18540Q5B; Manufacturer Part Number: CSD18540Q5B; RoHS: Compliant; Category: MOSFETs; Stock: 867; Pricing: 1=2,6866, 10=1,8382, 25=1,8215, 100=1,293, 250=1,2821, 500=1,0204 (USD); Contact Plating: Gold; Element Configuration: Single; Height: 0m; Lead Free: Contains Lead; Length: 5mm; Lifecycle Status: Production; Max Operating Temperature: 175°C; Min Operating Temperature: -55°C; Mounting Technology: Surface Mount; Pins: 8; Packaging: Tape & Reel (TR); Schedule B: 8541290080, 8541290080|8541290080|8541290080|8541290080|8541290080; Thickness: 950µm; Width: 5mm; ComponentLink1URL: https://datasheet.octopart.com:443/CSD18540Q5B-Texas-Instruments-datasheet-41215267.pdf?src-supplier=Texas+Instruments; ComponentLink1Description: https://datasheet.octopart.com:443/CSD18540Q5B-Texas-Instruments-datasheet-41215267.pdf?src-supplier=Texas+Instruments; ComponentLink2URL: https://octopart.com:443/opatz8j6/c1?t=SUskelIlBWIo_nWBJiAx1_ldGWU3oeiOn-EJs-5do1YusiS-JDvlKRrouVl-Y20ao-5z_08mEvz_AeJefeF_pOrLs0WfjhDJ2_xgnnOXWDpra4Cd3mKzckoQ6QanCMAXyB-vVCGNjBMeeyDAJ_8AtgWzG5J-VV0M2AC15IA14uOxBYYbIO1uRZi3YsibPr8OpLgj2-g8ey3MShCBBxtcPxAJXU9zClIpSD2jte82BFzbVJ9hhAzdJsrLZ3RNwxiUfmRI5v2vfH2Xq2tWnkVJNmbpw4R6VYt-2jb8TG9SzpqJvWz5ux_mibd2tkPbQSuE4I96mnLqjONPYMf24_myiaENOmBZXsZhO5Lu3rDJDhrEeNYScROBq6ZJRXBJXpuxfZxAZ_Uv9q79&src-supplier=Texas+Instruments; ComponentLink2Description: https://octopart.com:443/opatz8j6/c1?t=SUskelIlBWIo_nWBJiAx1_ldGWU3oeiOn-EJs-5do1YusiS-JDvlKRrouVl-Y20ao-5z_08mEvz_AeJefeF_pOrLs0WfjhDJ2_xgnnOXWDpra4Cd3mKzckoQ6QanCMAXyB-vVCGNjBMeeyDAJ_8AtgWzG5J-VV0M2AC15IA14uOxBYYbIO1uRZi3YsibPr8OpLgj2-g8ey3MShCBBxtcPxAJXU9zClIpSD2jte82BFzbVJ9hhAzdJsrLZ3RNwxiUfmRI5v2vfH2Xq2tWnkVJNmbpw4R6VYt-2jb8TG9SzpqJvWz5ux_mibd2tkPbQSuE4I96mnLqjONPYMf24_myiaENOmBZXsZhO5Lu3rDJDhrEeNYScROBq6ZJRXBJXpuxfZxAZ_Uv9q79&src-supplier=Texas+Instruments; ComponentLink3URL: https://datasheet.octopart.com:443/CSD18540Q5B-Texas-Instruments-datasheet-27303987.pdf?src-supplier=Texas+Instruments; ComponentLink3Description: https://datasheet.octopart.com:443/CSD18540Q5B-Texas-Instruments-datasheet-27303987.pdf?src-supplier=Texas+Instruments; ComponentLink4URL: https://datasheet.octopart.com:443/CSD18540Q5B-Texas-Instruments-datasheet-145028107.pdf?src-supplier=Arrow.cn; ComponentLink4Description: https://datasheet.octopart.com:443/CSD18540Q5B-Texas-Instruments-datasheet-145028107.pdf?src-supplier=Arrow.cn; ComponentLink5URL: http://sigma.octopart.com:80/reach_statement/Texas-Instruments-company-64.pdf?src-supplier=Compliance+Statements; ComponentLink5Description: http://sigma.octopart.com:80/reach_statement/Texas-Instruments-company-64.pdf?src-supplier=Compliance+Statements; ComponentLink6URL: http://sigma.octopart.com:80/conflict_mineral_statement/Texas-Instruments-company-63.pdf?src-supplier=Compliance+Statements; ComponentLink6Description: http://sigma.octopart.com:80/conflict_mineral_statement/Texas-Instruments-company-63.pdf?src-supplier=Compliance+Statements
Q9 = CSD18563Q5A: 60-V, N channel NexFET™ power MOSFET, single SON 5 mm x 6 mm, 6.8 mOhm 8-VSONP -55 to 150; Manufacturer: Texas Instruments; Manufacturer Lifecycle Status: ACTIVE; Continuous Drain Current (ID): 15A; Drain to Source Breakdown Voltage: 60V; Drain to Source Resistance: 5.7mΩ; Fall Time: 1.7ns; Gate to Source Voltage (Vgs): 20V; Input Capacitance: 1.5nF; Max Junction Temperature (Tj): 150°C; Max Power Dissipation: 3.2W; Nominal Vgs: 2V; Number of Channels: 1; Rds On Max: 6.8mΩ; Rise Time: 6.3ns; Turn-Off Delay Time: 11.4ns; Turn-On Delay Time: 3.2ns; Supplier: Arrow Electronics; Supplier Part Number: CSD18563Q5A; Manufacturer Part Number: CSD18563Q5A; RoHS: Compliant; Category: MOSFETs; Stock: 310; Pricing: 1=1,8015, 10=1,1755, 25=1,153, 100=0,7897, 250=0,4809 (USD); Case/Package: SMD/SMT; Contact Plating: Tin; Drain to Source Voltage (Vdss): 60V; Element Configuration: Single; Height: 1.1mm; Lead Free: Contains Lead; Length: 4.9mm; Lifecycle Status: Production; Max Operating Temperature: 150°C; Min Operating Temperature: -55°C; Mounting Technology: Surface Mount; Number of Elements: 1; Pins: 8; Power Dissipation: 3.2W; REACH SVHC: No; Schedule B: 8541290080, 8541290080|8541290080|8541290080|8541290080|8541290080; Thickness: 1mm; Threshold Voltage: 2V; Width: 6mm; ComponentLink1URL: https://sigma.octopart.com:443/184372194/technical_drawing/Texas-Instruments-CSD18563Q5A.pdf?src-supplier=Texas+Instruments; ComponentLink1Description: https://sigma.octopart.com:443/184372194/technical_drawing/Texas-Instruments-CSD18563Q5A.pdf?src-supplier=Texas+Instruments; ComponentLink2URL: https://octopart.com:443/opatz8j6/c1?t=cDlHP-nwod-UrTS5MQLBpnpDYKU81KfXZd0WIxwHVyDluJBsD-qzddP2QWeYshZMVLFvn-XXXUKwo92E12vZ99vTC2tuXrARVDgOfcVWHlEWklqGN5tuVZ0larHJnItfrHBea9QDmv9vipM55Nvz6p-GjLR-rQwE0UZqnFc0Fzik9ED-naljrhRUinUxGXB2zY_Vm7YgAsUc4yyz_KvlWjbFS2EmqwPzcjQvljt88dnThRaGs5pTcMpNDCZ9sQhtjnDwdEPZWIy2Ed_tCU4jqxfdHRCg7_eWsHlZMWqOTd8HLFQ2xB1v7dbSuqbTagO1wEqc8I0-XetWFPjRjBDhhXWC8TqTZ-VysNuLBAr14a3cqhDsGdgDzKCCn-w2NiCMrzY4ccQXQDbT&src-supplier=Texas+Instruments; ComponentLink2Description: https://octopart.com:443/opatz8j6/c1?t=cDlHP-nwod-UrTS5MQLBpnpDYKU81KfXZd0WIxwHVyDluJBsD-qzddP2QWeYshZMVLFvn-XXXUKwo92E12vZ99vTC2tuXrARVDgOfcVWHlEWklqGN5tuVZ0larHJnItfrHBea9QDmv9vipM55Nvz6p-GjLR-rQwE0UZqnFc0Fzik9ED-naljrhRUinUxGXB2zY_Vm7YgAsUc4yyz_KvlWjbFS2EmqwPzcjQvljt88dnThRaGs5pTcMpNDCZ9sQhtjnDwdEPZWIy2Ed_tCU4jqxfdHRCg7_eWsHlZMWqOTd8HLFQ2xB1v7dbSuqbTagO1wEqc8I0-XetWFPjRjBDhhXWC8TqTZ-VysNuLBAr14a3cqhDsGdgDzKCCn-w2NiCMrzY4ccQXQDbT&src-supplier=Texas+Instruments; ComponentLink3URL: https://sigma.octopart.com:443/183468693/technical_drawing/Texas-Instruments-CSD18563Q5A.pdf?src-supplier=Texas+Instruments; ComponentLink3Description: https://sigma.octopart.com:443/183468693/technical_drawing/Texas-Instruments-CSD18563Q5A.pdf?src-supplier=Texas+Instruments; ComponentLink4URL: https://datasheet.octopart.com:443/CSD18563Q5A-Texas-Instruments-datasheet-36993140.pdf?src-supplier=Texas+Instruments; ComponentLink4Description: https://datasheet.octopart.com:443/CSD18563Q5A-Texas-Instruments-datasheet-36993140.pdf?src-supplier=Texas+Instruments; ComponentLink5URL: https://datasheet.octopart.com:443/CSD18563Q5A-Texas-Instruments-datasheet-21773002.pdf?src-supplier=Texas+Instruments; ComponentLink5Description: https://datasheet.octopart.com:443/CSD18563Q5A-Texas-Instruments-datasheet-21773002.pdf?src-supplier=Texas+Instruments; ComponentLink6URL: https://datasheet.octopart.com:443/CSD18563Q5A-Texas-Instruments-datasheet-16941254.pdf?src-supplier=Texas+Instruments; ComponentLink6Description: https://datasheet.octopart.com:443/CSD18563Q5A-Texas-Instruments-datasheet-16941254.pdf?src-supplier=Texas+Instruments; ComponentLink7URL: https://datasheet.octopart.com:443/CSD18563Q5A-Texas-Instruments-datasheet-41215268.pdf?src-supplier=Farnell; ComponentLink7Description: https://datasheet.octopart.com:443/CSD18563Q5A-Texas-Instruments-datasheet-41215268.pdf?src-supplier=Farnell; ComponentLink8URL: https://datasheet.octopart.com:443/CSD18563Q5A-Texas-Instruments-datasheet-97084075.pdf?src-supplier=Newark; ComponentLink8Description: https://datasheet.octopart.com:443/CSD18563Q5A-Texas-Instruments-datasheet-97084075.pdf?src-supplier=Newark; ComponentLink9URL: https://datasheet.octopart.com:443/CSD18563Q5A-Texas-Instruments-datasheet-62115722.pdf?src-supplier=Newark; ComponentLink9Description: https://datasheet.octopart.com:443/CSD18563Q5A-Texas-Instruments-datasheet-62115722.pdf?src-supplier=Newark; ComponentLink10URL: https://datasheet.octopart.com:443/CSD18563Q5A-Texas-Instruments-datasheet-33010040.pdf?src-supplier=Newark; ComponentLink10Description: https://datasheet.octopart.com:443/CSD18563Q5A-Texas-Instruments-datasheet-33010040.pdf?src-supplier=Newark; ComponentLink11URL: https://datasheet.octopart.com:443/CSD18563Q5A-Texas-Instruments-datasheet-21220899.pdf?src-supplier=Newark; ComponentLink11Description: https://datasheet.octopart.com:443/CSD18563Q5A-Texas-Instruments-datasheet-21220899.pdf?src-supplier=Newark; ComponentLink12URL: https://datasheet.octopart.com:443/CSD18563Q5A-Texas-Instruments-datasheet-164413840.pdf?src-supplier=Augswan; ComponentLink12Description: https://datasheet.octopart.com:443/CSD18563Q5A-Texas-Instruments-datasheet-164413840.pdf?src-supplier=Augswan; ComponentLink13URL: https://datasheet.octopart.com:443/CSD18563Q5A-Texas-Instruments-datasheet-159114916.pdf?src-supplier=LCSC; ComponentLink13Description: https://datasheet.octopart.com:443/CSD18563Q5A-Texas-Instruments-datasheet-159114916.pdf?src-supplier=LCSC; ComponentLink14URL: https://datasheet.octopart.com:443/CSD18563Q5A-Texas-Instruments-datasheet-142046464.pdf?src-supplier=Arrow.cn; ComponentLink14Description: https://datasheet.octopart.com:443/CSD18563Q5A-Texas-Instruments-datasheet-142046464.pdf?src-supplier=Arrow.cn; ComponentLink15URL: http://sigma.octopart.com:80/reach_statement/Texas-Instruments-company-64.pdf?src-supplier=Compliance+Statements; ComponentLink15Description: http://sigma.octopart.com:80/reach_statement/Texas-Instruments-company-64.pdf?src-supplier=Compliance+Statements; ComponentLink16URL: http://sigma.octopart.com:80/conflict_mineral_statement/Texas-Instruments-company-63.pdf?src-supplier=Compliance+Statements; ComponentLink16Description: http://sigma.octopart.com:80/conflict_mineral_statement/Texas-Instruments-company-63.pdf?src-supplier=Compliance+Statements